# Altium schematic sheet P10_ESP32_1.SchDoc
size A4; SheetNumber: 2; SheetTotal: 2
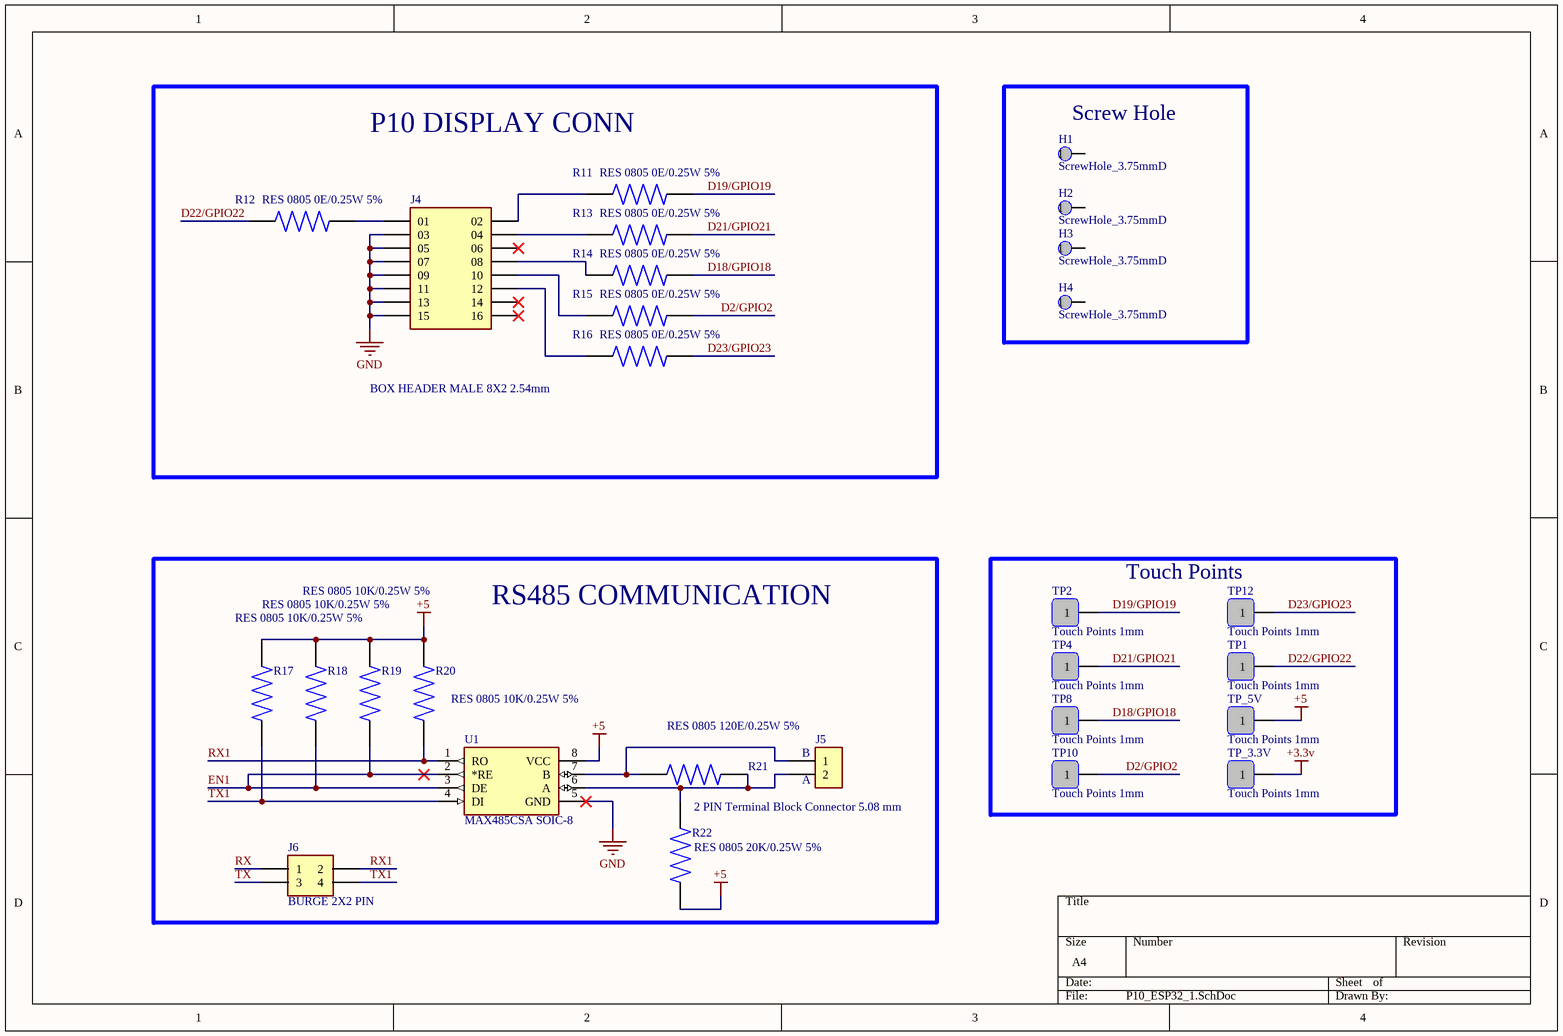
[diagram p0: P10_ESP32_1.SchDoc]

## Parts
H1  ScrewHole_3.75mmD  [ScrewHole_3.75mmD]
H2  ScrewHole_3.75mmD  [ScrewHole_3.75mmD]
H3  ScrewHole_3.75mmD  [ScrewHole_3.75mmD]
H4  ScrewHole_3.75mmD  [ScrewHole_3.75mmD]
J4  BOX HEADER MALE 8X2 2.54mm  [BOX HEADER MALE 8X2 2.54mm]
J5  2 PIN Terminal Block Connector 5.08 mm  [2 PIN Terminal Block Connector 5.08 mm]
J6  BURGE 2X2 PIN  [BURGE 2X2 pin]
R11  RES 0805 0E/0.25W 5%  [RES 0805 10K/0.25W 5%]
R12  RES 0805 0E/0.25W 5%  [RES 0805 10K/0.25W 5%]
R13  RES 0805 0E/0.25W 5%  [RES 0805 10K/0.25W 5%]
R14  RES 0805 0E/0.25W 5%  [RES 0805 10K/0.25W 5%]
R15  RES 0805 0E/0.25W 5%  [RES 0805 10K/0.25W 5%]
R16  RES 0805 0E/0.25W 5%  [RES 0805 10K/0.25W 5%]
R17  RES 0805 10K/0.25W 5%  [RES 0805 10K/0.25W 5%]
R18  RES 0805 10K/0.25W 5%  [RES 0805 10K/0.25W 5%]
R19  RES 0805 10K/0.25W 5%  [RES 0805 10K/0.25W 5%]
R20  RES 0805 10K/0.25W 5%  [RES 0805 10K/0.25W 5%]
R21  RES 0805 120E/0.25W 5%  [RES 0805 10K/0.25W 5%]
R22  RES 0805 20K/0.25W 5%  [RES 0805 10K/0.25W 5%]
TP1  Touch Points 1mm  [Touch Points 1mm]
TP2  Touch Points 1mm  [Touch Points 1mm]
TP4  Touch Points 1mm  [Touch Points 1mm]
TP8  Touch Points 1mm  [Touch Points 1mm]
TP10  Touch Points 1mm  [Touch Points 1mm]
TP12  Touch Points 1mm  [Touch Points 1mm]
TP_3.3V  Touch Points 1mm  [Touch Points 1mm]
TP_5V  Touch Points 1mm  [Touch Points 1mm]
U1  MAX485CSA SOIC-8  [MAX485CSA]

## Blocks framed on the sheet
P10 DISPLAY CONN: J4 R11-R16
Screw Hole: H1-H4
RS485 COMMUNICATION: J5 J6 R17-R22 U1
Touch Points: TP1 TP2 TP4 TP8 TP10 TP12 TP_3.3V TP_5V

## Nets
+3.3v: TP_3.3V.1
+5: R17.2 R18.2 R19.2 R20.2 R22.1 TP_5V.1 U1.8(VCC)
GND: J4.03 J4.05 J4.07 J4.09 J4.11 J4.13 J4.15 U1.5(GND)
D2/GPIO2: R15.2 TP10.1
D18/GPIO18: R14.2 TP8.1
D19/GPIO19: R11.2 TP2.1
D21/GPIO21: R13.2 TP4.1
D22/GPIO22: R12.1 TP1.1
D23/GPIO23: R16.2 TP12.1
EN1: R18.1 R19.1 U1.2(*RE) U1.3(DE)
RX: J6.01(1)
RX1: J6.02(2) R20.1 U1.1(RO)
TX: J6.03(3)
TX1: J6.04(4) R17.1 U1.4(DI)
NetJ4_01: J4.01 R12.2
NetJ4_02: J4.02 R11.1
NetJ4_04: J4.04 R13.1
NetJ4_08: J4.08 R14.1
NetJ4_10: J4.10 R15.1
NetJ4_12: J4.12 R16.1
NetJ5_1: J5.1 R21.1 U1.7(B)
NetJ5_2: J5.2 R21.2 R22.2 U1.6(A)

Not connected (* = marked no-connect by the designer): H1 1; H2 1; H3 1; H4 1; J4 06* 14* 16*

## Notes on the sheet
- (near J5) A
- (near J5) B

## Library data of the parts
H1-H4 = ScrewHole_3.75mmD: SCREW HEAD DIA 4.5MM, SREW LEG DIA 3 MM
J4 = BOX HEADER MALE 8X2 2.54mm: BOX HEADER MALE 8X2 2.54mm 16 pin; MP: TSS-108-01-T-D; Availability: Unavailable; Value: *; Price: None; Package: None
J5 = 2 PIN Terminal Block Connector 5.08 mm: MOLEX,Screw Type, Horizontal, 5.08 Pitch, 24~12 (AWG), Terminal Block Connector, TB007-508-02BE; MF: Same Sky; SnapEDA_Link: https://www.snapeda.com/parts/TB007-508-02BE/Same+Sky/view-part/?ref=snap; Package: None; Value: *; MP: TB007-508-02BE; Check_prices: https://www.snapeda.com/parts/TB007-508-02BE/Same+Sky/view-part/?ref=eda
J6 = 4PIN BURGE: Connector Header Through Hole 4 position 0.100 (2.54mm), 2X2 PIN; MF: Samtec; MP: MTLW-102-05-G-D-180; SnapEDA_Link: https://www.snapeda.com/parts/MTLW-102-05-G-D-180/Samtec/view-part/?ref=snap; Package: None; Value: *; Check_prices: https://www.snapeda.com/parts/MTLW-102-05-G-D-180/Samtec/view-part/?ref=eda
R11-R22 = RES 0805 10K/0.25W 5%: RESISTOR, THICK FILM, 10K, 5%, 0805, FRESISTOR, THICK FILM, 10K, 5%, 0805, FULL REEL Product Range:PANASONIC - ERJ Series; MP: ERJ-6GEYJ103V; MF: Panasonic Electronic; Price: None; Check_prices: https://www.snapeda.com/parts/ERJ-6GEYJ103V/Panasonic+Electronic+Components/view-part/?ref=eda; Package: 805-2 Panasonic; Purchase-URL: https://pricing.snapeda.com/search/part/ERJ-6GEYJ103V/?ref=eda; Availability: In Stock; SnapEDA_Link: https://www.snapeda.com/parts/ERJ-6GEYJ103V/Panasonic+Electronic+Components/view-part/?ref=snap; Value: *
TP1 TP2 TP4 TP8 TP10 TP12 TP_3.3V TP_5V = Touch Points: Touch Points 0.75mm to1mm
U1 = MAX485CSA: MAX485CSA-RS-485/RS-422 Transceivers, SOIC-8; MF: Analog Devices; MP: MAX485CSA+; SnapEDA_Link: https://www.snapeda.com/parts/MAX485CSA+/Analog+Devices/view-part/?ref=snap; Package: SOIC-8 Maxim; Value: *; Check_prices: https://www.snapeda.com/parts/MAX485CSA+/Analog+Devices/view-part/?ref=eda